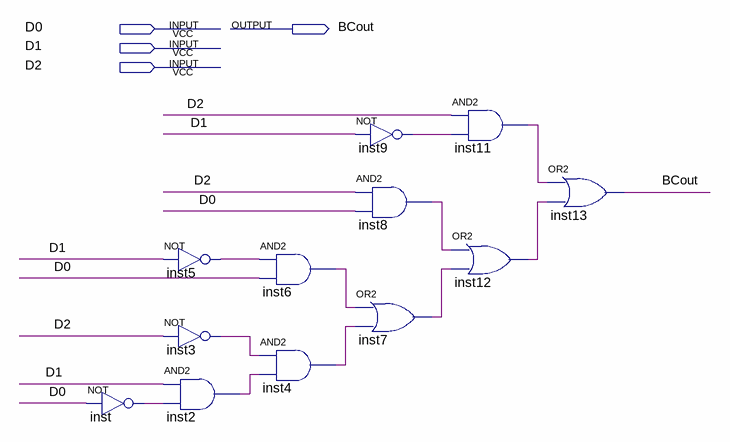
[diagram p0: schematic sheet]
// Quartus schematic BC-Logic.bdf as structural Verilog: 12 symbols, 4 pins
module \BC-Logic  (
  input  D0,
  input  D1,
  input  D2,
  output BCout
);

  wire inst2_out, inst3_out, inst4_out, inst5_out, inst6_out, inst7_out, inst8_out, inst9_out, inst11_out,
       inst12_out, inst_out;

  not inst (inst_out, D0);
  not inst5 (inst5_out, D1);
  not inst3 (inst3_out, D2);
  and inst2 (inst2_out, D1, inst_out);
  and inst6 (inst6_out, inst5_out, D0);
  and inst4 (inst4_out, inst3_out, inst2_out);
  not inst9 (inst9_out, D1);
  and inst8 (inst8_out, D2, D0);
  or inst7 (inst7_out, inst6_out, inst4_out);
  and inst11 (inst11_out, D2, inst9_out);
  or inst12 (inst12_out, inst8_out, inst7_out);
  or inst13 (BCout, inst11_out, inst12_out);
endmodule
